# Altium project 变压器电源模块.PrjPCB
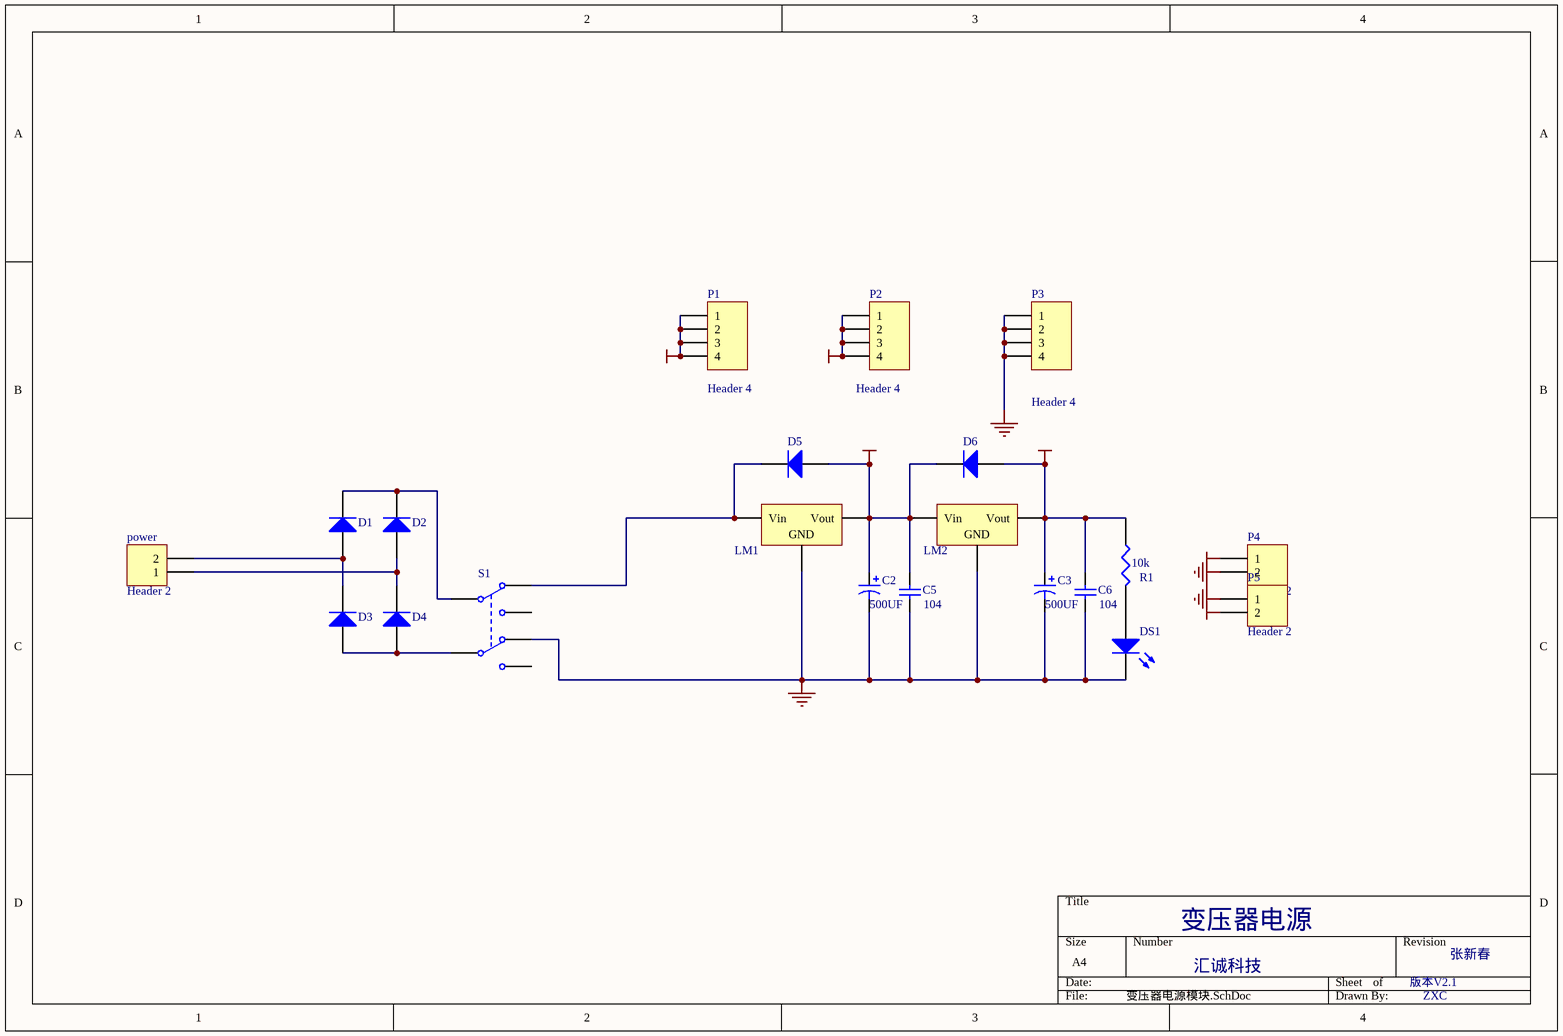
[diagram p0: 变压器电源模块.SchDoc]
1 sheet, 21 parts. Net scope: global (net labels, ports and power ports of the same name join across sheets).
Board file: 变压器电源模块.PcbDoc

## Sheet 变压器电源模块.SchDoc
size A4

### Parts
C2  value 500UF  [C 220/50]
C3  value 500UF  [C 220/50]
C5  value 104  [HDR1X2]
C6  value 104  [HDR1X2]
D1  (no value)  [DIO7.8-4.6x2]
D2  (no value)  [DIO7.8-4.6x2]
D3  (no value)  [DIO7.8-4.6x2]
D4  (no value)  [DIO7.8-4.6x2]
D5  (no value)  [DIO10.46-5.3x2.8]
D6  (no value)  [DIO10.46-5.3x2.8]
DS1  (no value)  [HDR1X2]
LM1  (no value)  [wyk]
LM2  (no value)  [wyk]
P1  Header 4  [HDR1X4]
P2  Header 4  [HDR1X4]
P3  Header 4  [HDR1X4]
P4  Header 2  [JK128]
P5  Header 2  [JK128]
power  Header 2  [JK128]
R1  10k  [HDR1X2]
S1  (no value)  [DPDT-6]

### Nets
A05: C3.1 C6.2 D6.1(A) LM2.3(Vout) P2.1 P2.2 P2.3 P2.4 P5.2 R1.1
A12: C2.1 C5.2 D5.1(A) D6.2(K) LM1.3(Vout) LM2.1(Vin) P1.1 P1.2 P1.3 P1.4 P4.1
AGND: C2.2 C3.2 C5.1 C6.1 DS1.2(K) LM1.2(GND) LM2.2(GND) P3.1 P3.2 P3.3 P3.4 P4.2 S1.4(NC2)
BGND: P5.1
NetD1_1: D1.1(A) D3.2(K) power.2
NetD1_2: D1.2(K) D2.2(K) S1.1(COMMON1)
NetD2_1: D2.1(A) D4.2(K) power.1
NetD3_1: D3.1(A) D4.1(A) S1.5(COMMON2)
NetD5_2: D5.2(K) LM1.1(Vin) S1.2(NC1)
NetDS1_1: DS1.1(A) R1.2

Not connected (* = marked no-connect by the designer): S1 3(NO1) 6(NO2)

### Notes on the sheet
- 变压器电源
- 汇诚科技
- 版本V2.1
- 张新春
- ZXC

### Library data of the parts
C2 C3 = Cap Pol1: Polarized Capacitor (Radial); Published: 8-Jun-2000; LatestRevisionDate: 17-Jul-2002; LatestRevisionNote: Re-released for DXP Platform.; Publisher: Altium Limited
C5 C6 = Cap: Capacitor; Published: 8-Jun-2000; LatestRevisionDate: 17-Jul-2002; LatestRevisionNote: Re-released for DXP Platform.; Publisher: Altium Limited
D1-D6 = Diode 1N4007: 1 Amp General Purpose Rectifier; Published: 8-Jun-2000; LatestRevisionDate: 17-Jul-2002; LatestRevisionNote: Re-released for DXP Platform.; DatasheetDocument: 1998; PackageDocument: Aug-1999; PackageReference: DO-41; Publisher: Altium Limited; Code_JEDEC: DO-204-AL
DS1 = LED0: Typical INFRARED GaAs LED; Published: 8-Jun-2000; LatestRevisionDate: 17-Jul-2002; LatestRevisionNote: Re-released for DXP Platform.; Publisher: Altium Limited
LM1 LM2 = Volt Reg: Voltage Regulator; Published: 24-Mar-1999; LatestRevisionDate: 17-Jul-2002; LatestRevisionNote: Re-released for DXP Platform.; Publisher: Altium Limited; Code_JEDEC: SMD-220
P1-P3 = Header 4: Header, 4-Pin; LatestRevisionDate: 17-Jul-2002; LatestRevisionNote: Re-released for DXP Platform.; Publisher: Altium Limited
P4 P5 power = Header 2: Header, 2-Pin; LatestRevisionDate: 17-Jul-2002; LatestRevisionNote: Re-released for DXP Platform.; Publisher: Altium Limited
R1 = RES1
S1 = SW DPDT: Switch; Published: 24-Mar-1999; LatestRevisionDate: 17-Jul-2002; LatestRevisionNote: Re-released for DXP Platform.; Publisher: Altium Limited